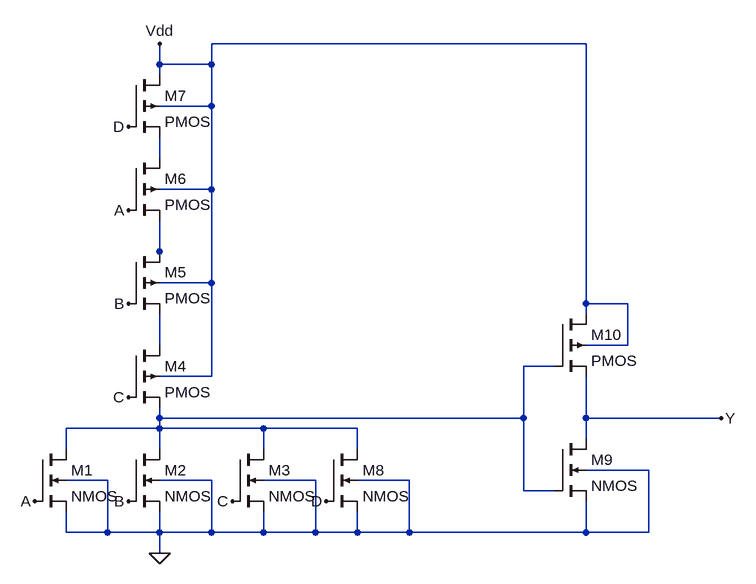
[diagram p0: schematic OR4.asc]
OR4.asc, the LTspice schematic file:
Version 4
SHEET 1 960 680
WIRE 720 -160 144 -160
WIRE 64 -128 64 -160
WIRE 144 -128 144 -160
WIRE 144 -128 64 -128
WIRE 64 -112 64 -128
WIRE 144 -64 144 -128
WIRE 144 -64 64 -64
WIRE 64 16 64 -16
WIRE 144 64 144 -64
WIRE 144 64 64 64
WIRE 64 160 64 112
WIRE 64 176 64 160
WIRE 144 208 144 64
WIRE 144 208 64 208
WIRE 720 240 720 -160
WIRE 784 240 720 240
WIRE 720 256 720 240
WIRE 64 304 64 256
WIRE 784 304 784 240
WIRE 784 304 720 304
WIRE 672 336 624 336
WIRE 144 352 144 208
WIRE 144 352 64 352
WIRE 64 416 64 400
WIRE 624 416 624 336
WIRE 624 416 64 416
WIRE 720 416 720 352
WIRE 928 416 720 416
WIRE 64 432 64 416
WIRE 64 432 -80 432
WIRE 224 432 64 432
WIRE 368 432 224 432
WIRE 720 448 720 416
WIRE -80 464 -80 432
WIRE 64 464 64 432
WIRE 224 464 224 432
WIRE 368 464 368 432
WIRE 816 496 720 496
WIRE -16 512 -80 512
WIRE 144 512 64 512
WIRE 304 512 224 512
WIRE 448 512 368 512
WIRE 624 528 624 416
WIRE 672 528 624 528
WIRE -80 592 -80 560
WIRE -16 592 -16 512
WIRE -16 592 -80 592
WIRE 64 592 64 560
WIRE 64 592 -16 592
WIRE 144 592 144 512
WIRE 144 592 64 592
WIRE 224 592 224 560
WIRE 224 592 144 592
WIRE 304 592 304 512
WIRE 304 592 224 592
WIRE 368 592 368 560
WIRE 368 592 304 592
WIRE 448 592 448 512
WIRE 448 592 368 592
WIRE 720 592 720 544
WIRE 720 592 448 592
WIRE 816 592 816 496
WIRE 816 592 720 592
WIRE 64 624 64 592
FLAG 64 624 0
FLAG 16 96 A
FLAG 16 240 B
FLAG 16 384 C
FLAG -128 544 A
FLAG 16 544 B
FLAG 176 544 C
FLAG 64 -160 Vdd
FLAG 16 -32 D
FLAG 320 544 D
FLAG 928 416 Y
SYMBOL nmos4 -128 464 R0
SYMATTR InstName M1
SYMBOL nmos4 16 464 R0
SYMATTR InstName M2
SYMBOL nmos4 176 464 R0
SYMATTR InstName M3
SYMBOL pmos4 16 304 R0
SYMATTR InstName M4
SYMBOL pmos4 16 160 R0
SYMATTR InstName M5
SYMBOL pmos4 16 16 R0
SYMATTR InstName M6
SYMBOL pmos4 16 -112 R0
SYMATTR InstName M7
SYMBOL nmos4 320 464 R0
SYMATTR InstName M8
SYMBOL nmos4 672 448 R0
SYMATTR InstName M9
SYMBOL pmos4 672 256 R0
SYMATTR InstName M10

The netlist it stands for:
* OR4.asc
M1 N004 A 0 0 NMOS
M2 N004 B 0 0 NMOS
M3 N004 C 0 0 NMOS
M4 N003 C N004 Vdd PMOS
M5 N002 B N003 Vdd PMOS
M6 N001 A N002 Vdd PMOS
M7 Vdd D N001 Vdd PMOS
M8 N004 D 0 0 NMOS
M9 Y N004 0 0 NMOS
M10 Vdd N004 Y Vdd PMOS
.model NMOS NMOS
.model PMOS PMOS
.lib standard.mos
.backanno
.end